# EasyEDA schematic easyeda2.json
TITLE: Sheet_1; REV: 1.0; Date: 2024-07-05; Sheet: 1/1; Company: Your Company
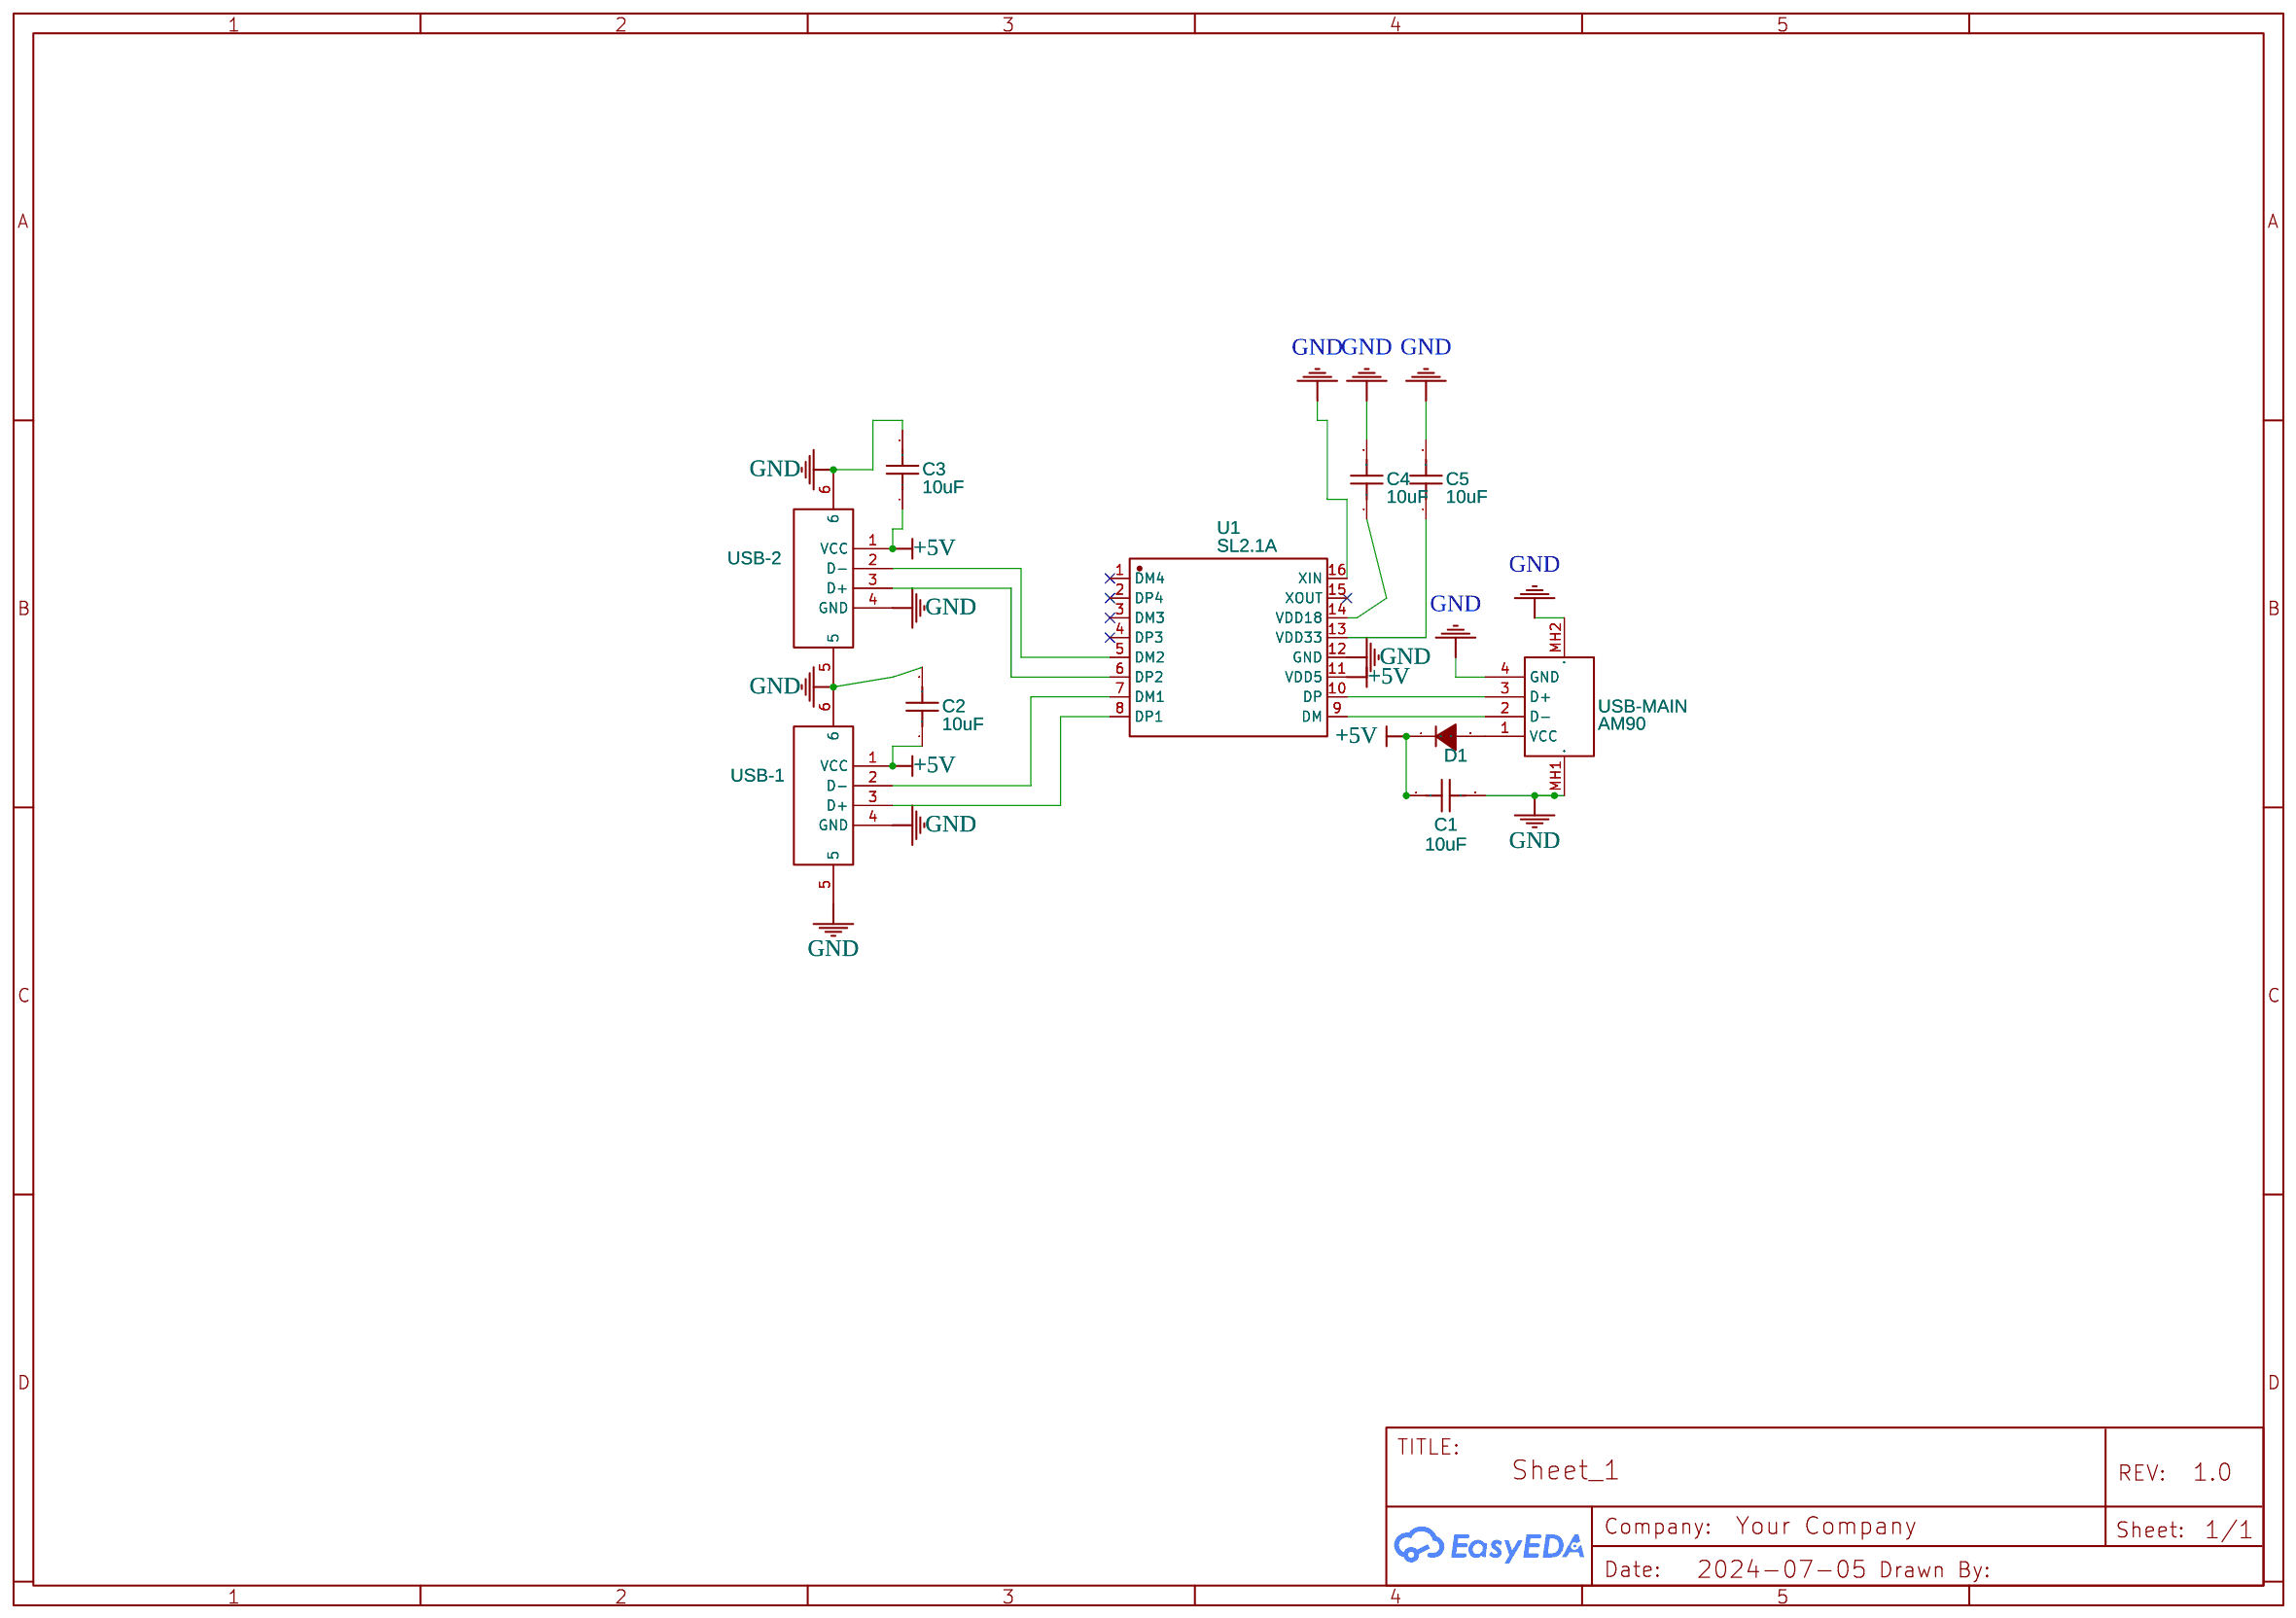
[diagram p0: schematic sheet]

## Parts
C1  10uF  [C0603]
C2  10uF  [C0603]
C3  10uF  [C0603]
C4  10uF  [C0603]
C5  10uF  [C0603]
D1  NSR0320MW2T1G  [SOD-323_L1.8-W1.3-LS2.5-RD]
U1  SL2.1A  [SOP-16_L10.0-W3.9-P1.27-LS6.0-BL]
USB-1  USB-AF-90-14.4X13.6-H7.0-DIP  [USB-A-TH_C46407]
USB-2  USB-AF-90-14.4X13.6-H7.0-DIP  [USB-A-TH_C46407]
USB-MAIN  AM90  [USB-AM-TH_AM90]

## Library data of the parts
C1-C5 = CL10A106KP8NNNC: Supplier: LCSC; Manufacturer: SAMSUNG(三星); Supplier Part: C19702; JLCPCB Part Class: Basic Part
D1 = NSR0320MW2T1G: Supplier: LCSC; Manufacturer: onsemi(安森美); Supplier Part: C48192; JLCPCB Part Class: Extended Part
U1 = SL2.1A: Contributor: LCSC; Supplier: LCSC; Supplier Part: C192893; Manufacturer: CoreChips(和芯润德); JLCPCB Part Class: Extended Part
USB-1 USB-2 = USB-AF-90-14.4X13.6-H7.0-DIP: Contributor: LCSC; Supplier: LCSC; Supplier Part: C46407; Manufacturer: 精拓金; Manufacturer Part: 903-131A1011D10100; JLCPCB Part Class: Extended Part
USB-MAIN = AM90: Contributor: LCSC; Supplier: LCSC; Supplier Part: C404965; Manufacturer: SHOU HAN(首韩); JLCPCB Part Class: Extended Part

## Nets
+5V: C1.1 C2.1 C3.1 D1.1(C) U1.11(VDD5) USB-1.1(VCC) USB-2.1(VCC)
GND: C1.2 C2.2 C3.2 C4.2 C5.2 U1.12(GND) U1.16(XIN) USB-1.4(GND) USB-1.5 USB-1.6 USB-2.4(GND) USB-2.5 USB-2.6 USB-MAIN.4(GND) USB-MAIN.MH1 USB-MAIN.MH2
Net-(C4-1): C4.1 U1.14(VDD18)
Net-(C5-1): C5.1 U1.13(VDD33)
Net-(D1-2): D1.2(A) USB-MAIN.1(VCC)
Net-(U1-5): U1.5(DM2) USB-2.2(D-)
Net-(U1-6): U1.6(DP2) USB-2.3(D+)
Net-(U1-7): U1.7(DM1) USB-1.2(D-)
Net-(U1-8): U1.8(DP1) USB-1.3(D+)
Net-(U1-9): U1.9(DM) USB-MAIN.2(D-)
Net-(U1-10): U1.10(DP) USB-MAIN.3(D+)

Not connected (* = marked no-connect by the designer): U1 1(DM4)* 2(DP4)* 3(DM3)* 4(DP3)* 15(XOUT)*
